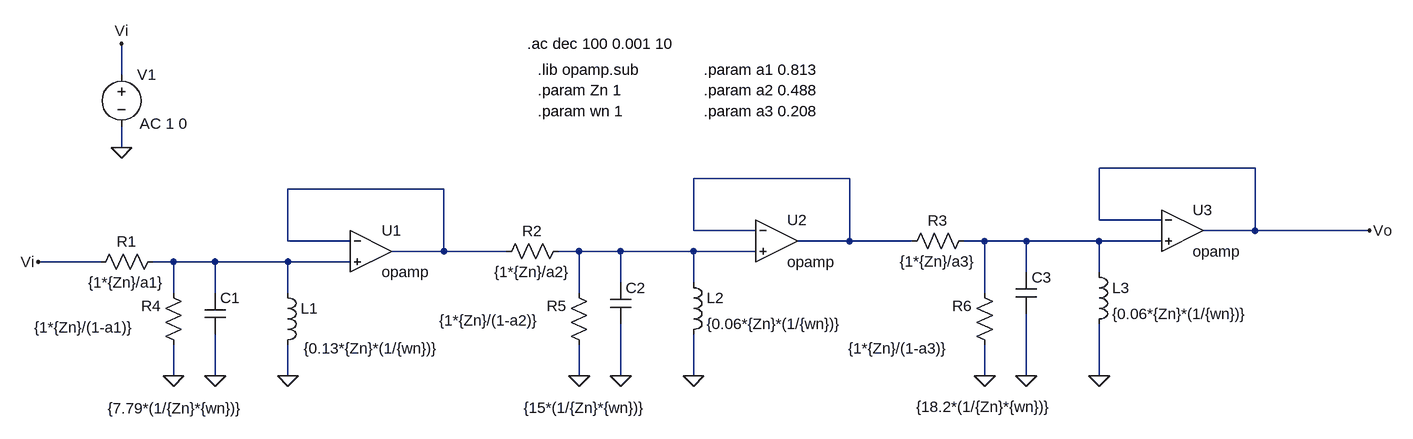
[diagram p0: schematic Circuito_2.asc]
Circuito_2.asc, the LTspice schematic file:
Version 4
SHEET 1 1968 680
WIRE -240 -160 -240 -208
WIRE -240 -48 -240 -80
WIRE 1504 -16 1264 -16
WIRE 880 0 640 0
WIRE 256 16 16 16
WIRE 1264 64 1264 -16
WIRE 1360 64 1264 64
WIRE 640 80 640 0
WIRE 736 80 640 80
WIRE 1504 80 1504 -16
WIRE 1504 80 1424 80
WIRE 1680 80 1504 80
WIRE 16 96 16 16
WIRE 112 96 16 96
WIRE 880 96 880 0
WIRE 880 96 800 96
WIRE 976 96 880 96
WIRE 1088 96 1056 96
WIRE 1152 96 1088 96
WIRE 1264 96 1152 96
WIRE 1360 96 1264 96
WIRE 256 112 256 16
WIRE 256 112 176 112
WIRE 352 112 256 112
WIRE 464 112 432 112
WIRE 528 112 464 112
WIRE 640 112 528 112
WIRE 736 112 640 112
WIRE -272 128 -368 128
WIRE -160 128 -192 128
WIRE -96 128 -160 128
WIRE 16 128 -96 128
WIRE 112 128 16 128
WIRE 1152 144 1152 96
WIRE 1264 144 1264 96
WIRE 528 160 528 112
WIRE 640 160 640 112
WIRE -160 176 -160 128
WIRE -96 176 -96 128
WIRE 16 176 16 128
WIRE 464 176 464 112
WIRE 1088 176 1088 96
WIRE -160 304 -160 256
WIRE -96 304 -96 240
WIRE 16 304 16 256
WIRE 464 304 464 256
WIRE 528 304 528 224
WIRE 640 304 640 240
WIRE 1088 304 1088 256
WIRE 1152 304 1152 208
WIRE 1264 304 1264 224
FLAG -96 304 0
FLAG 16 304 0
FLAG -368 128 Vi
FLAG -240 -208 Vi
FLAG -240 -48 0
FLAG 528 304 0
FLAG 640 304 0
FLAG 1152 304 0
FLAG 1264 304 0
FLAG 1680 80 Vo
FLAG -160 304 0
FLAG 464 304 0
FLAG 1088 304 0
SYMBOL OpAmps\\opamp 144 48 R0
SYMATTR InstName U1
SYMBOL res -176 112 R90
WINDOW 0 0 56 VBottom 2
WINDOW 3 32 56 VTop 2
SYMATTR InstName R1
SYMATTR Value {1*{Zn}/a1}
SYMBOL cap -112 176 R0
WINDOW 3 -149 178 Left 2
SYMATTR Value {7.79*(1/{Zn}*{wn})}
SYMATTR InstName C1
SYMBOL ind 0 160 R0
WINDOW 3 40 101 Left 2
SYMATTR InstName L1
SYMATTR Value {0.13*{Zn}*(1/{wn})}
SYMBOL OpAmps\\opamp 768 32 R0
SYMATTR InstName U2
SYMBOL res 448 96 R90
WINDOW 0 0 56 VBottom 2
WINDOW 3 32 56 VTop 2
SYMATTR InstName R2
SYMATTR Value {1*{Zn}/a2}
SYMBOL cap 512 160 R0
WINDOW 3 -133 193 Left 2
SYMATTR Value {15*(1/{Zn}*{wn})}
SYMATTR InstName C2
SYMBOL ind 624 144 R0
SYMATTR InstName L2
SYMATTR Value {0.06*{Zn}*(1/{wn})}
SYMBOL OpAmps\\opamp 1392 16 R0
SYMATTR InstName U3
SYMBOL res 1072 80 R90
WINDOW 0 0 56 VBottom 2
WINDOW 3 32 56 VTop 2
SYMATTR InstName R3
SYMATTR Value {1*{Zn}/a3}
SYMBOL cap 1136 144 R0
WINDOW 3 -153 207 Left 2
SYMATTR Value {18.2*(1/{Zn}*{wn})}
SYMATTR InstName C3
SYMBOL ind 1248 128 R0
SYMATTR InstName L3
SYMATTR Value {0.06*{Zn}*(1/{wn})}
SYMBOL voltage -240 -176 R0
WINDOW 123 28 91 Left 2
WINDOW 39 0 0 Left 0
SYMATTR Value2 AC 1 0
SYMATTR InstName V1
SYMATTR Value ""
SYMBOL res -176 160 R0
WINDOW 0 -34 36 Left 2
WINDOW 3 -198 69 Left 2
SYMATTR InstName R4
SYMATTR Value {1*{Zn}/(1-a1)}
SYMBOL res 448 160 R0
WINDOW 0 -34 36 Left 2
WINDOW 3 -199 58 Left 2
SYMATTR InstName R5
SYMATTR Value {1*{Zn}/(1-a2)}
SYMBOL res 1072 160 R0
WINDOW 0 -34 36 Left 2
WINDOW 3 -194 101 Left 2
SYMATTR InstName R6
SYMATTR Value {1*{Zn}/(1-a3)}
TEXT 400 -168 Left 2 !.lib opamp.sub
TEXT 400 -136 Left 2 !.param Zn 1
TEXT 400 -104 Left 2 !.param wn 1
TEXT 384 -208 Left 2 !.ac dec 100 0.001 10
TEXT 656 -168 Left 2 !.param a1 0.813
TEXT 656 -136 Left 2 !.param a2 0.488
TEXT 656 -104 Left 2 !.param a3 0.208

The netlist it stands for:
* Circuito_2.asc
XU1 N002 N005 N002 opamp Aol=100K GBW=10Meg  ; pins invin noninvin out
R1 N005 Vi {1*{Zn}/a1}
C1 N005 0 {7.79*(1/{Zn}*{wn})}
L1 N005 0 {0.13*{Zn}*(1/{wn})}
XU2 N001 N004 N001 opamp Aol=100K GBW=10Meg  ; pins invin noninvin out
R2 N004 N002 {1*{Zn}/a2}
C2 N004 0 {15*(1/{Zn}*{wn})}
L2 N004 0 {0.06*{Zn}*(1/{wn})}
XU3 Vo N003 Vo opamp Aol=100K GBW=10Meg  ; pins invin noninvin out
R3 N003 N001 {1*{Zn}/a3}
C3 N003 0 {18.2*(1/{Zn}*{wn})}
L3 N003 0 {0.06*{Zn}*(1/{wn})}
V1 Vi 0 AC 1 0
R4 N005 0 {1*{Zn}/(1-a1)}
R5 N004 0 {1*{Zn}/(1-a2)}
R6 N003 0 {1*{Zn}/(1-a3)}
.lib opamp.sub
.param Zn 1
.param wn 1
.ac dec 100 0.001 10
.param a1 0.813
.param a2 0.488
.param a3 0.208
.backanno
.end